# Altium project ET-master.PrjPCB
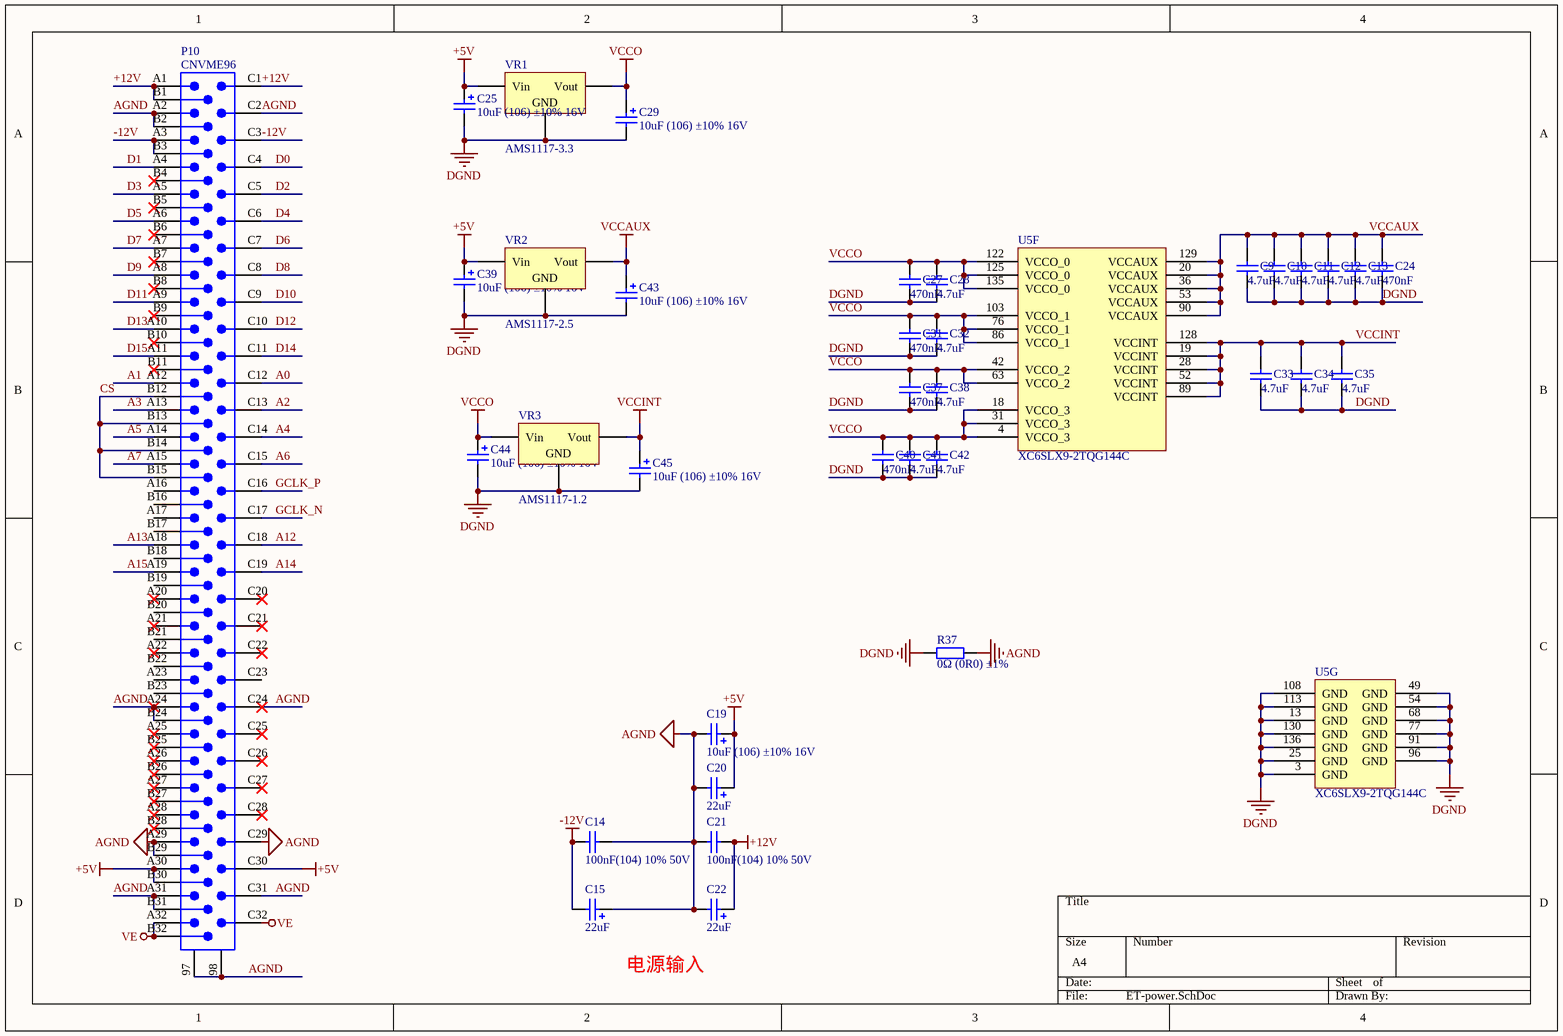
[diagram p0: ET-power.SchDoc]
2 sheets, 57 parts. Net scope: global (net labels, ports and power ports of the same name join across sheets).
Board file: ET-master.PcbDoc
Sheets:
  ET-power.SchDoc
  ET-USB.SchDoc

## Sheet ET-power.SchDoc
size A4

### Parts
C9  4.7uF  [LC-0805_C]
C10  4.7uF  [LC-0805_C]
C11  4.7uF  [LC-0805_C]
C12  4.7uF  [LC-0805_C]
C13  4.7uF  [LC-0805_C]
C14  100nF(104) 10% 50V  [LC-0805_C]
C15  22uF  [CASE-E_7343]
C19  10uF (106) ±10% 16V  [LC-CASE-A_3216]
C20  22uF  [CASE-E_7343]
C21  100nF(104) 10% 50V  [LC-0805_C]
C22  22uF  [CASE-E_7343]
C24  470nF  [LC-0805_C]
C25  10uF (106) ±10% 16V  [LC-CASE-A_3216]
C27  470nF  [LC-0805_C]
C28  4.7uF  [LC-0805_C]
C29  10uF (106) ±10% 16V  [LC-CASE-A_3216]
C31  470nF  [LC-0805_C]
C32  4.7uF  [LC-0805_C]
C33  4.7uF  [LC-0805_C]
C34  4.7uF  [LC-0805_C]
C35  4.7uF  [LC-0805_C]
C37  470nF  [LC-0805_C]
C38  4.7uF  [LC-0805_C]
C39  10uF (106) ±10% 16V  [LC-CASE-A_3216]
C40  470nF  [LC-0805_C]
C41  4.7uF  [LC-0805_C]
C42  4.7uF  [LC-0805_C]
C43  10uF (106) ±10% 16V  [LC-CASE-A_3216]
C44  10uF (106) ±10% 16V  [LC-CASE-A_3216]
C45  10uF (106) ±10% 16V  [LC-CASE-A_3216]
P10  CNVME96  [CNVME96]
R37  0Ω (0R0) ±1%  [LC-0805_R]
U5  XC6SLX9-2TQG144C  [TQG144_N]  (parts F,G of 7)
VR1  AMS1117-3.3  [LC-SOT-223]
VR2  AMS1117-2.5  [LC-SOT-223]
VR3  AMS1117-1.2  [LC-SOT-223]

### Nets
+5V: C19.1 C20.1 C25.1 C39.1 P10.A30 P10.B30 P10.C30 VR1.3(Vin) VR2.3(Vin)
+12V: C21.2 C22.1 P10.A1 P10.B1 P10.C1
-12V: C14.1 C15.2 P10.A3 P10.B3 P10.C3
AGND: C14.2 C15.1 C19.2 C20.2 C21.1 C22.2 P10.97 P10.98 P10.A2 P10.A24 P10.A29 P10.A31 P10.B2 P10.B24 P10.B29 P10.B31 P10.C2 P10.C24 P10.C29 P10.C31 R37.2
DGND: C9.1 C10.1 C11.1 C12.1 C13.1 C24.1 C25.2 C27.1 C28.1 C29.2 C31.1 C32.1 C33.1 C34.1 C35.1 C37.1 C38.1 C39.2 C40.1 C41.1 C42.1 C43.2 C44.2 C45.2 R37.1 U5.3(GND) U5.13(GND) U5.25(GND) U5.49(GND) U5.54(GND) U5.68(GND) U5.77(GND) U5.91(GND) U5.96(GND) U5.108(GND) U5.113(GND) U5.130(GND) U5.136(GND) VR1.1(GND) VR2.1(GND) VR3.1(GND)
VCCAUX: C9.2 C10.2 C11.2 C12.2 C13.2 C24.2 C43.1 U5.20(VCCAUX) U5.36(VCCAUX) U5.53(VCCAUX) U5.90(VCCAUX) U5.129(VCCAUX) VR2.2(Vout)
VCCINT: C33.2 C34.2 C35.2 C45.1 U5.19(VCCINT) U5.28(VCCINT) U5.52(VCCINT) U5.89(VCCINT) U5.128(VCCINT) VR3.2(Vout)
VCCO: C27.2 C28.2 C29.1 C31.2 C32.2 C37.2 C38.2 C40.2 C41.2 C42.2 C44.1 U5.4(VCCO_3) U5.18(VCCO_3) U5.31(VCCO_3) U5.42(VCCO_2) U5.63(VCCO_2) U5.76(VCCO_1) U5.86(VCCO_1) U5.103(VCCO_1) U5.122(VCCO_0) U5.125(VCCO_0) U5.135(VCCO_0) VR1.2(Vout) VR3.3(Vin)
VE: P10.A32 P10.B32 P10.C32
A0: P10.C12
A1: P10.A12
A2: P10.C13
A3: P10.A13
A4: P10.C14
A5: P10.A14
A6: P10.C15
A7: P10.A15
A12: P10.C18
A13: P10.A18
A14: P10.C19
A15: P10.A19
CS: P10.B12 P10.B13 P10.B14 P10.B15
D0: P10.C4
D1: P10.A4
D2: P10.C5
D3: P10.A5
D4: P10.C6
D5: P10.A6
D6: P10.C7
D7: P10.A7
D8: P10.C8
D9: P10.A8
D10: P10.C9
D11: P10.A9
D12: P10.C10
D13: P10.A10
D14: P10.C11
D15: P10.A11
GCLK_N: P10.C17
GCLK_P: P10.C16

Not connected (* = marked no-connect by the designer): P10 A16 A17 A20* A21* A22* A23 A25* A26* A27* A28* B4* B5* B6* B7* B8* B9* B10* B11* B16 B17 B18 B19 B20 B21 B22 B23 B25* B26* B27* B28* C20* C21* C22* C23 C25* C26* C27* C28*

### Notes on the sheet
- 电源输入

### Library data of the parts
C9-C13 C28 C32-C35 C38 C41 C42 = 0805 4.7uF (475) 10% 25V: 贴片电容; ComponentLink1Description: 供应商链接; ComponentLink1URL: http://www.szlcsc.com/product/details_2131.html; Package: 0805; Supplier: LC; SuppliersPartNumber: C1779
C14 C21 = 0805 100nF(104) 10% 50V: 贴片电容; ComponentLink1Description: 供应商链接; ComponentLink1URL: http://www.szlcsc.com/product/details_50686.html; Package: 0805; Supplier: LC; SuppliersPartNumber: C49678
C15 C20 C22 = 钽电容
C19 C25 C29 C39 C43-C45 = 3216 10uF (106) 10% 16V: 钽电容; ComponentLink1Description: 供应商链接; ComponentLink1URL: http://www.szlcsc.com/product/details_7643.html; Package: 3216; Supplier: LC; SuppliersPartNumber: C7171
C24 C27 C31 C37 C40 = 0805 470nF (474) 10% 50V: 贴片电容; ComponentLink1Description: 供应商链接; ComponentLink1URL: http://www.szlcsc.com/product/details_14623.html; Package: 0805; Supplier: LC; SuppliersPartNumber: C13967
P10 = CNVME96: 96-Pin Connector (3x32 2.54mm grid); Text Field6: Alternate Layout Available; Text Field7: Published 14-Feb-2002
R37 = 0805 0Ω (0R0) 1%: 贴片电阻; ComponentLink1Description: 供应商链接; ComponentLink1URL: http://www.szlcsc.com/product/details_18165.html; Package: 0805; Supplier: LC; SuppliersPartNumber: C17477
U5 = XC6SLX9-2TQG144C: Spartan-6 LX 1.2V FPGA, 102 User I/Os, 144-Pin TQFP (0.5mm Pitch), Speed Grade 2, Commercial Grade, Pb-Free; Published: 17-Nov-2009; DatasheetVersion: ver1.6, Nov-2010; PackageVersion: ver1.2, Jun-2004; PackageReference: TQG144; Publisher: Altium Limited; PackageDescription: 144-Pin Thin Quad Flat Pack (TQG144) - Pb-Free; Supplier 1: Digi-Key; Supplier Part Number 1: XC6SLX9-2TQG144C-ND; Code_JEDEC: MS-026-BFB; ComponentLink1Description: Manufacturer Link; ComponentLink1URL: http://www.xilinx.com; ComponentLink2Description: Spartan-6 Datasheet; ComponentLink2URL: http://www.xilinx.com/support/documentation/data_sheets/ds160.pdf; ComponentLink3Description: Spartan-6 Documents; ComponentLink3URL: http://www.xilinx.com/support/documentation/spartan-6.htm; ComponentLink4Description: Xilinx.com Home; ComponentLink4URL: http://www.xilinx.com
VR1 = SOT-223 AMS1117-3.3: 低压差线性稳压(LDO); ComponentLink1Description: 供应商链接; ComponentLink1URL: http://www.szlcsc.com/product/details_6652.html; Package: SOT-223; Supplier: LC; SuppliersPartNumber: C6186
VR2 = SOT-223 AMS1117-2.5: 低压差线性稳压(LDO); ComponentLink1Description: 供应商链接; ComponentLink1URL: http://www.szlcsc.com/product/details_6652.html; Package: SOT-223; Supplier: LC; SuppliersPartNumber: C6186
VR3 = SOT-223 AMS1117-1.2: 低压差线性稳压(LDO); ComponentLink1Description: 供应商链接; ComponentLink1URL: http://www.szlcsc.com/product/details_6652.html; Package: SOT-223; Supplier: LC; SuppliersPartNumber: C6186

## Sheet ET-USB.SchDoc
size A4
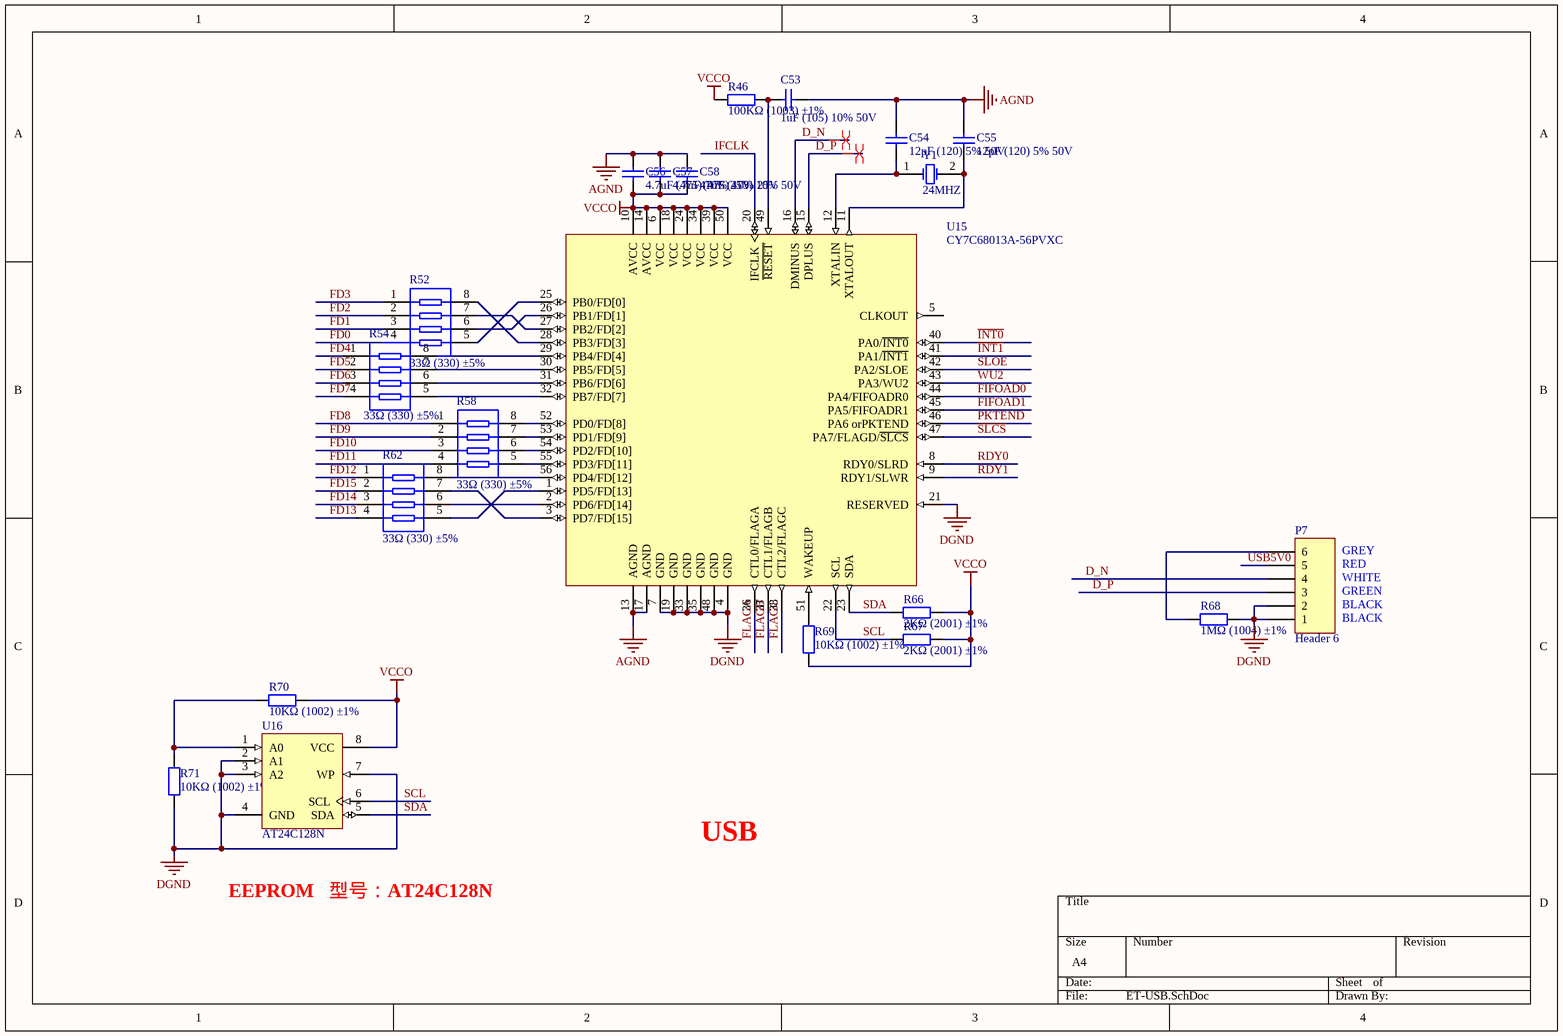
[diagram p1: ET-USB.SchDoc]

### Parts
C53  1uF (105) 10% 50V  [LC-0805_C]
C54  12pF (120) 5% 50V  [LC-0805_C]
C55  12pF (120) 5% 50V  [LC-0805_C]
C56  4.7uF (475) 10% 25V  [LC-0805_C]
C57  4.7uF (475) 10% 25V  [LC-0805_C]
C58  47nF (473) 10% 50V  [LC-0805_C]
P7  Header 6  [HDR1X6]
R46  100KΩ (1003) ±1%  [LC-0805_R]
R52  33Ω (330) ±5%  [LC-0402_Rx4]
R54  33Ω (330) ±5%  [LC-0402_Rx4]
R58  33Ω (330) ±5%  [LC-0402_Rx4]
R62  33Ω (330) ±5%  [LC-0402_Rx4]
R66  2KΩ (2001) ±1%  [LC-0805_R]
R67  2KΩ (2001) ±1%  [LC-0805_R]
R68  1MΩ (1004) ±1%  [LC-0805_R]
R69  10KΩ (1002) ±1%  [LC-0805_R]
R70  10KΩ (1002) ±1%  [LC-0805_R]
R71  10KΩ (1002) ±1%  [LC-0805_R]
U15  CY7C68013A-56PVXC  [O56_N]
U16  AT24C128N  [8P3]
Y1  24MHZ  [XTAL5]

### Nets
AGND: C53.2 C54.2 C55.2 C56.2 C57.2 C58.2 U15.13(AGND) U15.17(AGND)
DGND: P7.1 P7.2 R68.2 R71.1 U15.4(GND) U15.7(GND) U15.19(GND) U15.21(RESERVED) U15.33(GND) U15.35(GND) U15.48(GND) U16.2(A1) U16.3(A2) U16.4(GND) U16.7(WP)
VCCO: C56.1 C57.1 C58.1 R46.1 R66.2 R67.2 R69.1 R70.2 U15.6(VCC) U15.10(AVCC) U15.14(AVCC) U15.18(VCC) U15.24(VCC) U15.34(VCC) U15.39(VCC) U15.50(VCC) U16.8(VCC)
~{INT0}: U15.40(PA0/~{INT0})
~{INT1}: U15.41(PA1/~{INT1})
~{SLCS}: U15.47(PA7/FLAGD/~{SLCS})
D_N: P7.4 U15.16(DMINUS)
D_P: P7.3 U15.15(DPLUS)
FD0: R52.4
FD1: R52.3
FD2: R52.2
FD3: R52.1
FD4: R54.1
FD5: R54.2
FD6: R54.3
FD7: R54.4
FD8: R58.1
FD9: R58.2
FD10: R58.3
FD11: R58.4
FD12: R62.1
FD13: R62.4
FD14: R62.3
FD15: R62.2
FIFOAD0: U15.44(PA4/FIFOADR0)
FIFOAD1: U15.45(PA5/FIFOADR1)
FLAGA: U15.36(CTL0/FLAGA)
FLAGB: U15.37(CTL1/FLAGB)
FLAGC: U15.38(CTL2/FLAGC)
IFCLK: U15.20(IFCLK)
PKTEND: U15.46(PA6_orPKTEND)
RDY0: U15.8(RDY0/SLRD)
RDY1: U15.9(RDY1/SLWR)
SCL: R67.1 U15.22(SCL) U16.6(SCL)
SDA: R66.1 U15.23(SDA) U16.5(SDA)
SLOE: U15.42(PA2/SLOE)
USB5V0: P7.5
WU2: U15.43(PA3/WU2)
NetC53_1: C53.1 R46.2 U15.49(~{RESET})
NetC54_1: C54.1 U15.12(XTALIN) Y1.1(OSC1)
NetC55_1: C55.1 U15.11(XTALOUT) Y1.2(OSC2)
NetP7_6: P7.6 R68.1
NetR52_5: R52.5 U15.25(PB0/FD[0])
NetR52_6: R52.6 U15.26(PB1/FD[1])
NetR52_7: R52.7 U15.27(PB2/FD[2])
NetR52_8: R52.8 U15.28(PB3/FD[3])
NetR54_5: R54.5 U15.32(PB7/FD[7])
NetR54_6: R54.6 U15.31(PB6/FD[6])
NetR54_7: R54.7 U15.30(PB5/FD[5])
NetR54_8: R54.8 U15.29(PB4/FD[4])
NetR58_5: R58.5 U15.55(PD3/FD[11])
NetR58_6: R58.6 U15.54(PD2/FD[10])
NetR58_7: R58.7 U15.53(PD1/FD[9])
NetR58_8: R58.8 U15.52(PD0/FD[8])
NetR62_5: R62.5 U15.1(PD5/FD[13])
NetR62_6: R62.6 U15.2(PD6/FD[14])
NetR62_7: R62.7 U15.3(PD7/FD[15])
NetR62_8: R62.8 U15.56(PD4/FD[12])
NetR69_2: R69.2 U15.51(WAKEUP)
NetR70_1: R70.1 R71.2 U16.1(A0)

Not connected (* = marked no-connect by the designer): U15 5(CLKOUT)

### Layout directives
differential pair: D_N, D_P

### Notes on the sheet
- USB
- EEPROM   型号：AT24C128N
- Labels drawn without touching a wire or pin: BLACK, GREEN, GREY, RED, WHITE

### Library data of the parts
C53 = 0805 1uF (105) 10% 50V: 贴片电容; ComponentLink1Description: 供应商链接; ComponentLink1URL: http://www.szlcsc.com/product/details_29074.html; Package: 0805; Supplier: LC; SuppliersPartNumber: C28323
C54 C55 = 0805 12pF (120) 5% 50V: 贴片电容; ComponentLink1Description: 供应商链接; ComponentLink1URL: http://www.szlcsc.com/product/details_2144.html; Package: 0805; Supplier: LC; SuppliersPartNumber: C1792
C56 C57 = 0805 4.7uF (475) 10% 25V: 贴片电容; ComponentLink1Description: 供应商链接; ComponentLink1URL: http://www.szlcsc.com/product/details_2131.html; Package: 0805; Supplier: LC; SuppliersPartNumber: C1779
C58 = 0805 47nF (473) 10% 50V: 贴片电容; ComponentLink1Description: 供应商链接; ComponentLink1URL: http://www.szlcsc.com/product/details_54150.html; Package: 0805; Supplier: LC; SuppliersPartNumber: C53134
P7 = Header 6: Header, 6-Pin; LatestRevisionDate: 17-Jul-2002; LatestRevisionNote: Re-released for DXP Platform.; Publisher: Altium Limited
R46 = 0805 100KΩ (1003) 1%: 贴片电阻; ComponentLink1Description: 供应商链接; ComponentLink1URL: http://www.szlcsc.com/product/details_18095.html; Package: 0805; Supplier: LC; SuppliersPartNumber: C17407
R52 R54 R58 R62 = 0402*4 33Ω (330) 5%: 贴片排阻; ComponentLink1Description: 供应商链接; ComponentLink1URL: http://www.szlcsc.com/product/details_26244.html; Package: 0402*4; Supplier: LC; SuppliersPartNumber: C25501
R66 R67 = 0805 2KΩ (2001) 1%: 贴片电阻; ComponentLink1Description: 供应商链接; ComponentLink1URL: http://www.szlcsc.com/product/details_18292.html; Package: 0805; Supplier: LC; SuppliersPartNumber: C17604
R68 = 0805 1MΩ (1004) 1%: 贴片电阻; ComponentLink1Description: 供应商链接; ComponentLink1URL: http://www.szlcsc.com/product/details_18202.html; Package: 0805; Supplier: LC; SuppliersPartNumber: C17514
R69-R71 = 0805 10KΩ (1002) 1%: 贴片电阻; ComponentLink1Description: 供应商链接; ComponentLink1URL: http://www.szlcsc.com/product/details_18102.html; Package: 0805; Supplier: LC; SuppliersPartNumber: C17414
U15 = CY7C68013A-56PVXC: EZ-USB FX2LP USB Microcontroller Ideal for Non-Battery Powered Applications,16K RAM, 24 I/Os, 56-Pin SSOP, Pb-Free, Commercial Grade; Published: 16-Dec-2005; LatestRevisionDate: 20-Nov-2009; LatestRevisionNote: IPC-7351 Footprint Added.; DatasheetVersion: rev.J, Sep-2005; PackageVersion: Feb-2005; PackageReference: O56; Publisher: Altium Limited; PackageDescription: 56-Pin Small Outline Package 0.635 mm Pitch; Code_JEDEC: MO-118-AB; Code_IPC: SOP635P1035-56; ComponentLink1Description: Manufacturer Link; ComponentLink1URL: http://www.cypress.com/portal/server.pt; ComponentLink2Description: Datasheet; ComponentLink2URL: http://www.cypress.com/portal/server.pt/gateway/PTARGS_0_2_1524_209_259_43/http%3B/sjapp20.mis.cypress.com%3B7001/publishedcontent/publish/design_resources/datasheets/contents/cy7c68013a_5.pdf
U16 = AT24C128N: 1Kbit (128 x 8), 2-wire Bus Automotive Serial EEPROM with Write Protect, 2.5V, 8-Pin TSSOP, Bulk; Published: 20-Sep-2010; DatasheetVersion: 8517C,  Jan-2009; PackageVersion: revD, Dec-2009; PackageReference: 8A2; Publisher: Altium Limited; PackageDescription: 8-Lead, 4.4 mm Body, Plastic Thin Shrink Small Outline Package (TSSOP); Code_JEDEC: MO-153-AA; ComponentLink1Description: Manufacturer Link; ComponentLink1URL: http://www.atmel.com/products/serial/default.asp; ComponentLink2Description: Datasheet; ComponentLink2URL: http://www.atmel.com/dyn/resources/prod_documents/doc8517.pdf; ComponentLink3Description: Atmel.com Home; ComponentLink3URL: http://www.atmel.com
Y1 = XTAL: Crystal Oscillator; Published: 8-Jun-2000; LatestRevisionDate: 17-Jul-2002; LatestRevisionNote: Re-released for DXP Platform.; PackageReference: R38; Publisher: Altium Limited

## Nets that join several sheets
AGND: ET-power (21 pins), ET-USB (8 pins)
DGND: ET-power (41 pins), ET-USB (15 pins)
VCCO: ET-power (24 pins), ET-USB (17 pins)